# Altium schematic sheet sensors_module.SchDoc
size A4
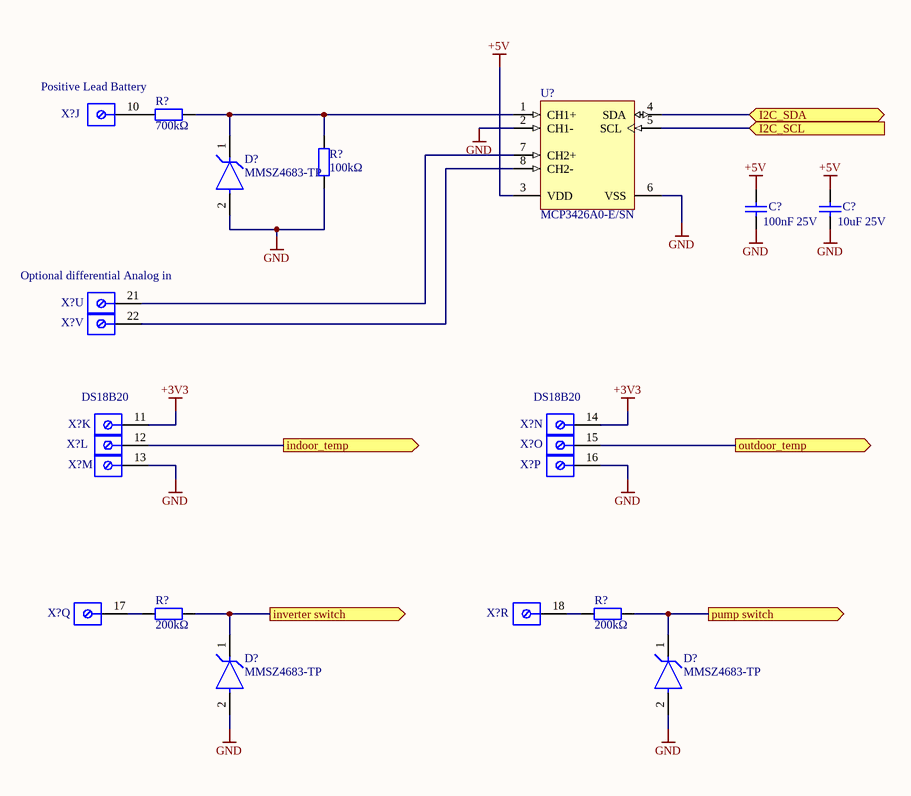
[diagram p0: sensors_module.SchDoc]

## Parts
(Parts that share a designator on the sheet are numbered #1, #2 ... from top to bottom, then left to right.)
C?#1  100nF 25V  [CAPC2013X88X50ML20T25]
C?#2  10uF 25V  [CAPC2013X88X50ML20T25]
D?#1  MMSZ4683-TP  [zenner_3v0]
D?#2  MMSZ4683-TP  [FP-SOD-123-MFG]
D?#3  MMSZ4683-TP  [FP-SOD-123-MFG]
R?#1  700kΩ  [RESC2013X50X30ML20T20]
R?#2  100kΩ  [RESC2013X50X30ML20T20]
R?#3  200kΩ  [RESC2013X50X30ML20T20]
R?#4  200kΩ  [RESC2013X50X30ML20T20]
U?  MCP3426A0-E/SN  [SOIC-SN8_L]
X?#1  connector  (value not drawn)  (part J of 22)
X?#2  connector  (value not drawn)  (part U of 22)
X?#3  connector  (value not drawn)  (part V of 22)
X?#4  connector  (value not drawn)  (part K of 22)
X?#5  connector  (value not drawn)  (part N of 22)
X?#6  connector  (value not drawn)  (part L of 22)
X?#7  connector  (value not drawn)  (part O of 22)
X?#8  connector  (value not drawn)  (part M of 22)
X?#9  connector  (value not drawn)  (part P of 22)
X?#10  connector  (value not drawn)  (part Q of 22)
X?#11  connector  (value not drawn)  (part R of 22)

## Ports
I2C_SCL (in), I2C_SDA (bidir), indoor_temp (out), inverter switch (out), outdoor_temp (out), pump switch (out)

## Nets
+3V3: X?#4.11 X?#5.14
+5V: C?#1.2 C?#2.2 U?.3(VDD)
GND: C?#1.1 C?#2.1 D?#1.2(A) D?#2.2(A) D?#3.2(A) R?#2.1 U?.2(CH1-) U?.6(VSS) X?#8.13 X?#9.16
I2C_SCL: U?.5(SCL) ; port I2C_SCL
I2C_SDA: U?.4(SDA) ; port I2C_SDA
indoor_temp: X?#6.12 ; port indoor_temp
inverter switch: D?#2.1(C) R?#3.1 ; port inverter switch
outdoor_temp: X?#7.15 ; port outdoor_temp
pump switch: D?#3.1(C) R?#4.1 ; port pump switch
NetD?#1_1: D?#1.1(C) R?#1.1 R?#2.2 U?.1(CH1+)
NetR?#1_2: R?#1.2 X?#1.10
NetR?#3_2: R?#3.2 X?#10.17
NetR?#4_2: R?#4.2 X?#11.18
NetU?_7: U?.7(CH2+) X?#2.21
NetU?_8: U?.8(CH2-) X?#3.22

## Notes on the sheet
- Positive Lead Battery
- (near X?#2) Optional differential Analog in
- (near X?#4) DS18B20
- (near X?#5) DS18B20

## Library data of the parts
C?#1 C?#2 = Cap_0805: Capacitor
D?#1 = zenner_3.0v: DIODE ZENER 3V 500MW SOD123; Element Configuration: Single; Voltage Tolerance: 5%; Peak Reverse Current: 800nA; Forward Voltage: 950mV; Package Quantity: 1; Packaging: Tape and Reel; Number of Pins: 2; Min Operating Temperature: -55°C; Radiation Hardening: No; Max Power Dissipation: 500mW; Power Dissipation: 500mW; Working Voltage: 3V; Max Operating Temperature: 150°C; Lead Free: Lead Free; Max Reverse Leakage Current: 800nA; Mount: Surface Mount; Zener Voltage: 3V; Tolerance: 5%
D?#2 D?#3 = CMP-56208-000004-1: DIODE ZENER 3V 500MW SOD123; Element Configuration: Single; Voltage Tolerance: 5%; Peak Reverse Current: 800nA; Forward Voltage: 950mV; Package Quantity: 1; Packaging: Tape and Reel; Number of Pins: 2; Min Operating Temperature: -55°C; Radiation Hardening: No; Max Power Dissipation: 500mW; Power Dissipation: 500mW; Working Voltage: 3V; Max Operating Temperature: 150°C; Lead Free: Lead Free; Max Reverse Leakage Current: 800nA; Mount: Surface Mount; Zener Voltage: 3V; Tolerance: 5%
R?#1-R?#4 = Res_0805: Resistor
U? = CMP-0188-01151-1: 16-Bit, Multi-Channel Delta-Sigma Analog-to-Digital Converter with I2C Interface and On-Board Reference, 8-Pin SOIC 150mil, Extended Temperature; ComponentLink2Description: Datasheet; ComponentLink3Description: Package Specification; PackageVersion: revBB, Aug-2009; Code_JEDEC: MS-012; Code_IPC: SOIC127P600-8; PackageDescription: 8-Lead Plastic Small Outline (SN) - Narrow, 3.90mm Body [SOIC]; ComponentLink1Description: Manufacturer URL; ComponentLink2URL: http://ww1.microchip.com/downloads/en/DeviceDoc/22226a.pdf; ComponentLink1URL: http://www.microchip.com/; DatasheetVersion: revA, Dec-2009; ComponentLink3URL: http://www.microchip.com/stellent/groups/techpub_sg/documents/packagingspec/en012702.pdf; PackageReference: SOIC-SN8